# EAGLE schematic goodbiosp10 (EAGLE 5.11)
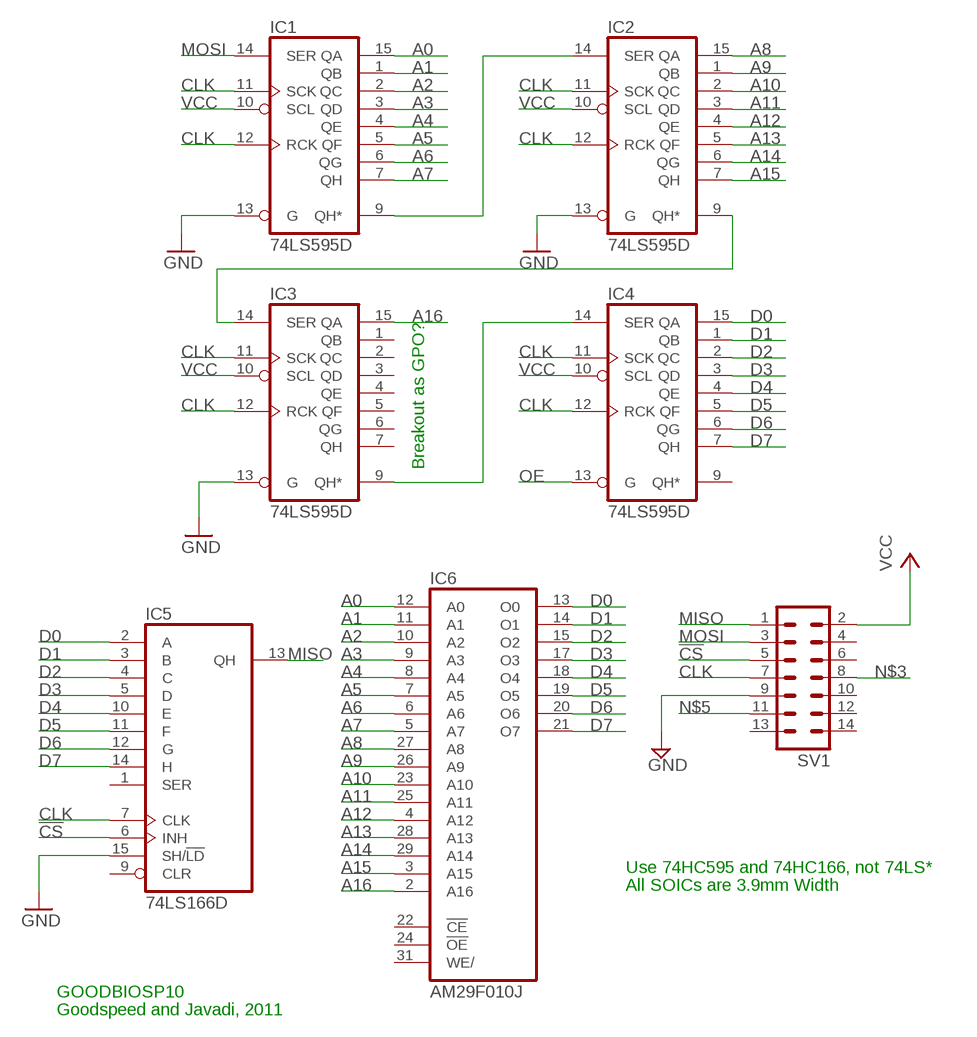
[diagram p0: schematic, sheet 1]

## Parts
IC1  74LS595D  [SO16]
IC2  74LS595D  [SO16]
IC3  74LS595D  [SO16]
IC4  74LS595D  [SO16]
IC5  74LS166D  [SO16]
IC6  AM29F010J  [PLCC32R]
SV1  MA07-2  [MA07-2]

## Nets
!CS: IC5.6(INH) SV1.5
A0: IC1.15(QA) IC6.12(A0)
A1: IC1.1(QB) IC6.11(A1)
A2: IC1.2(QC) IC6.10(A2)
A3: IC1.3(QD) IC6.9(A3)
A4: IC1.4(QE) IC6.8(A4)
A5: IC1.5(QF) IC6.7(A5)
A6: IC1.6(QG) IC6.6(A6)
A7: IC1.7(QH) IC6.5(A7)
A8: IC2.15(QA) IC6.27(A8)
A9: IC2.1(QB) IC6.26(A9)
A10: IC2.2(QC) IC6.23(A10)
A11: IC2.3(QD) IC6.25(A11)
A12: IC2.4(QE) IC6.4(A12)
A13: IC2.5(QF) IC6.28(A13)
A14: IC2.6(QG) IC6.29(A14)
A15: IC2.7(QH) IC6.3(A15)
A16: IC3.15(QA) IC6.2(A16)
CLK: IC1.11(SCK) IC1.12(RCK) IC2.11(SCK) IC2.12(RCK) IC3.11(SCK) IC3.12(RCK) IC4.11(SCK) IC4.12(RCK) IC5.7(CLK) SV1.7
D0: IC4.15(QA) IC5.2(A) IC6.13(O0)
D1: IC4.1(QB) IC5.3(B) IC6.14(O1)
D2: IC4.2(QC) IC5.4(C) IC6.15(O2)
D3: IC4.3(QD) IC5.5(D) IC6.17(O3)
D4: IC4.4(QE) IC5.10(E) IC6.18(O4)
D5: IC4.5(QF) IC5.11(F) IC6.19(O5)
D6: IC4.6(QG) IC5.12(G) IC6.20(O6)
D7: IC4.7(QH) IC5.14(H) IC6.21(O7)
GND: IC1.13(G) IC2.13(G) IC3.13(G) IC5.15(SH/!LD) SV1.9
MISO: IC5.13(QH) SV1.1
MOSI: IC1.14(SER) SV1.3
N$1: IC1.9(QH*) IC2.14(SER)
N$2: IC3.9(QH*) IC4.14(SER)
N$3: SV1.8
N$4: IC2.9(QH*) IC3.14(SER)
N$5: SV1.11
OE: IC4.13(G)
VCC: IC1.10(SCL) IC2.10(SCL) IC3.10(SCL) IC4.10(SCL) SV1.2
Unconnected: IC3.1(QB) IC3.2(QC) IC3.3(QD) IC3.4(QE) IC3.5(QF) IC3.6(QG) IC3.7(QH) IC4.9(QH*) IC5.1(SER) IC5.9(CLR) IC6.1(NC) IC6.22(!CE) IC6.24(!OE) IC6.30(NC) IC6.31(WE/) SV1.4 SV1.6 SV1.10 SV1.12 SV1.13 SV1.14

## Notes on the sheet
- Breakout as GPO?
- Use 74HC595 and 74HC166, not 74LS*
- All SOICs are 3.9mm Width
- GOODBIOSP10
- Goodspeed and Javadi, 2011

## Power pins joined to a net without a drawn wire
GND: IC1.8(GND) IC2.8(GND) IC3.8(GND) IC4.8(GND) IC5.8(GND) IC6.16(GND)
VCC: IC1.16(VCC) IC2.16(VCC) IC3.16(VCC) IC4.16(VCC) IC5.16(VCC) IC6.32(VCC)

## Library data of the parts
IC1-IC4 = 74xx-us:74*595: 8-bit SHIFT REGISTER, output latch
IC5 = 74xx-us:74*166: 8-bit parallel load SHIFT REGISTER
IC6 = am29-memory:AM29F010*: 1-Megabit FLASH MEMORY (128 K x 8 bit) 5 V-only
SV1 = con-lstb:MA07-2: PIN HEADER; OC_FARNELL: unknown; OC_NEWARK: unknown